# Altium schematic sheet LED_high_power.SchDoc: LED High Power
size B; SheetNumber: 12; SheetTotal: 14
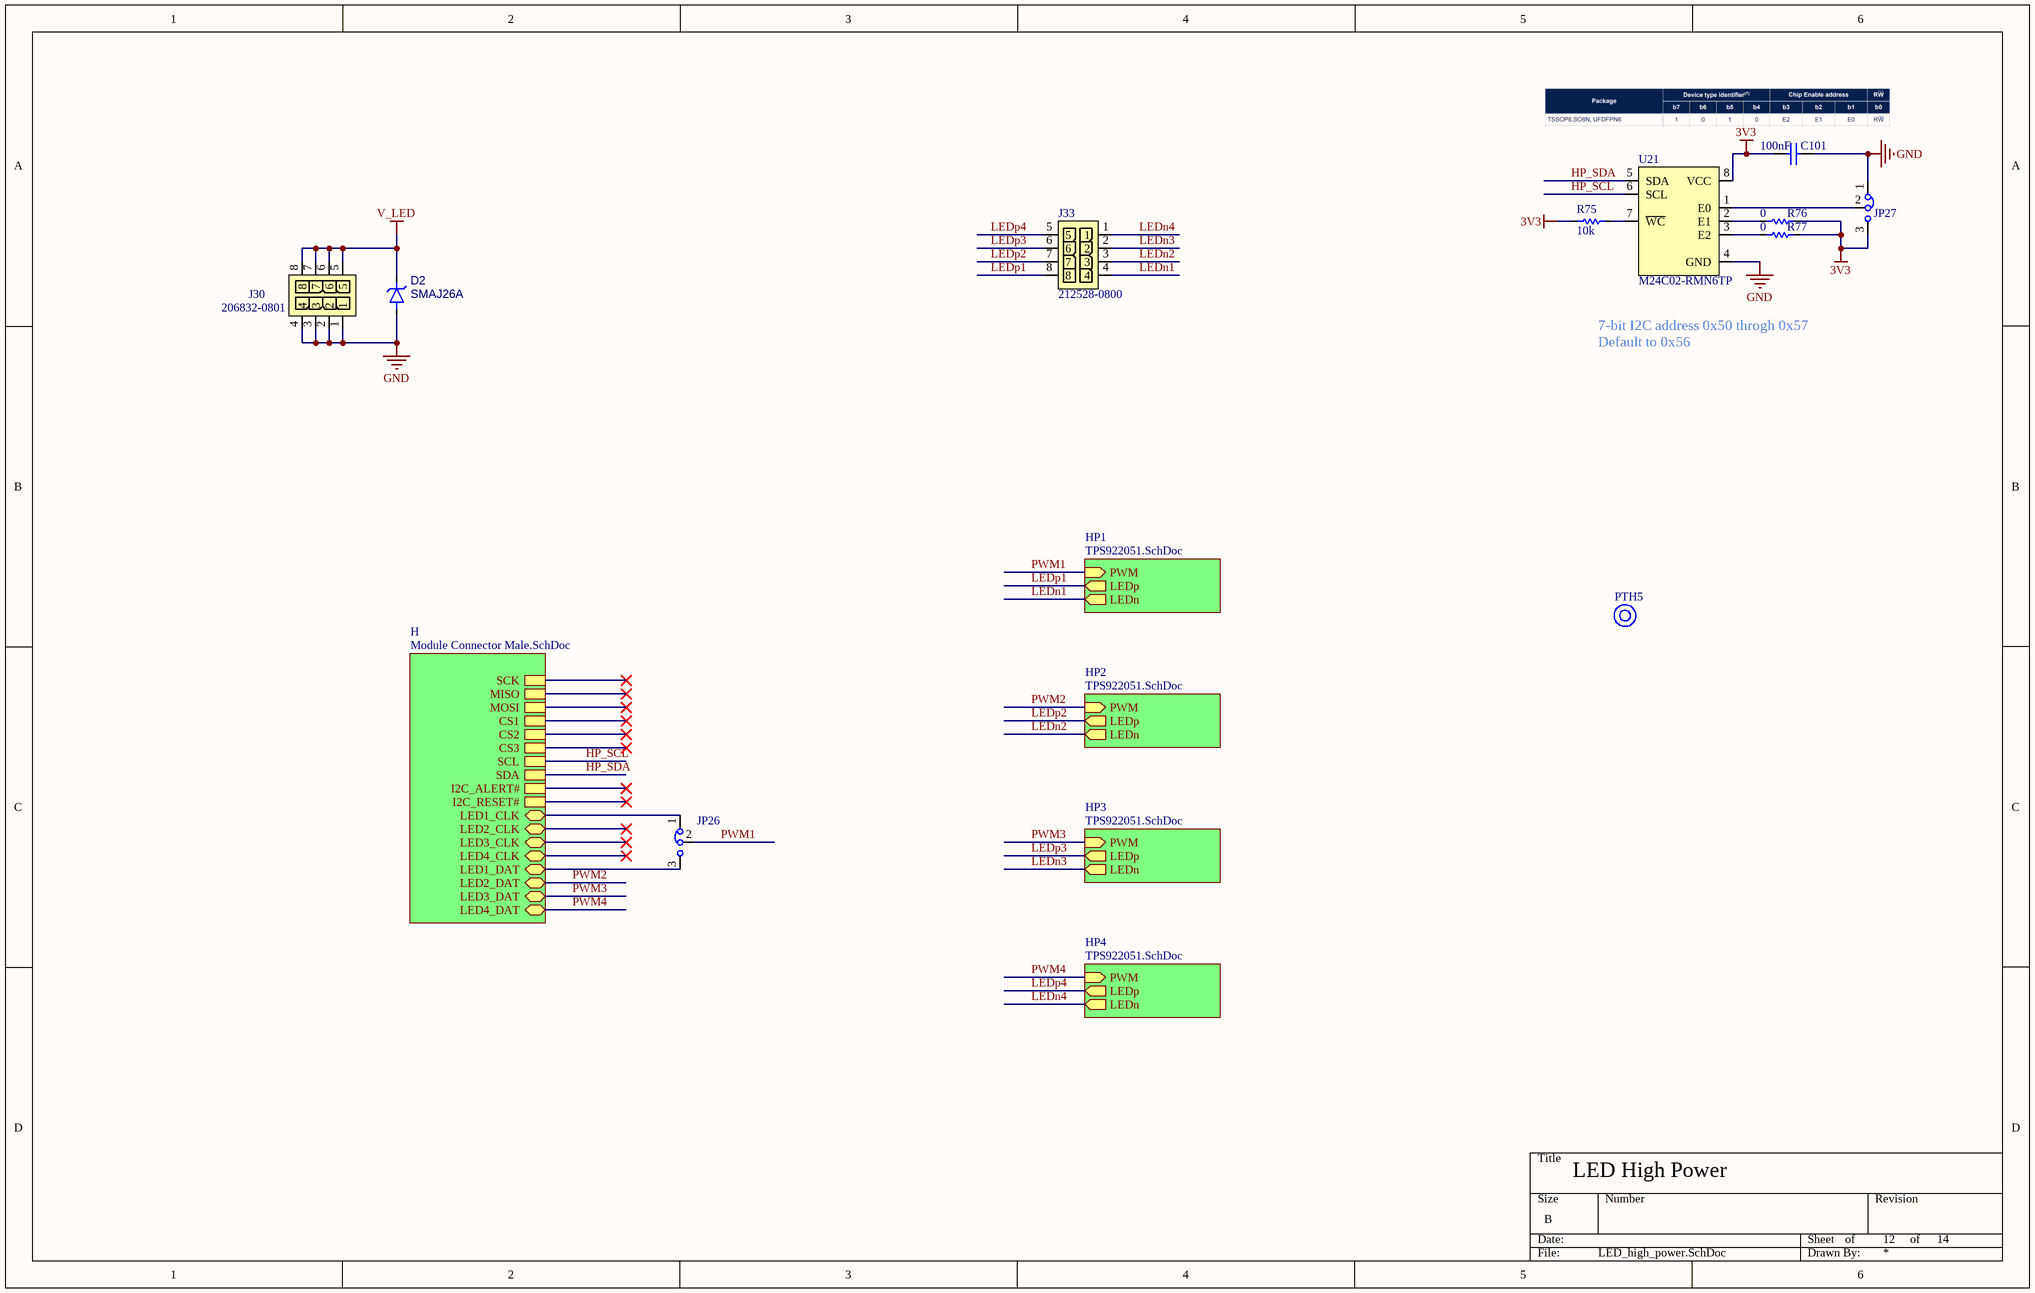
[diagram p0: LED_high_power.SchDoc]

## Parts
C101  value 100nF  [CAPC1608X10N_0603_MED]  (hidden comment: CC0603KRX7R0BB104)
D2  SMAJ26A  [FP-SMAJ-MFG]
J30  206832-0801  [206832-0801-Footprint-1]
J33  212528-0800  [212528-0800-Footprint]
JP26  Jumper 3 x 1 Bridge 1-2 Solder Bridge  [Jumper 3 Solder Bridge 1-2 0603]  (value not drawn)
JP27  Jumper 3 x 1 Bridge 1-2 Solder Bridge  [Jumper 3 Solder Bridge 1-2 0603]  (value not drawn)
PTH5  Mounting Hole NPTH  [Mounting Hole M3 No Washer NPTH]  (value not drawn)  (no BOM)
R75  value 10k  [RESC1608X06N_0603_MED]  (hidden comment: RC0603FR-1010KL)
R76  value 0  [RESC1608X06N_0603_MED]  (hidden comment: RC0603FR-070RL)
R77  value 0  [RESC1608X06N_0603_MED]  (hidden comment: RC0603FR-070RL)
U21  M24C02-RMN6TP  [M24C02-RMN6TP-SO8N-IPC_B]

## Sub-sheets
H = Module Connector Male.SchDoc: SCK, MISO, MOSI, CS1, CS2, CS3, SCL, SDA, I2C_ALERT#, I2C_RESET#, LED1_CLK (bidir), LED2_CLK (bidir), LED3_CLK (bidir), LED4_CLK (bidir), LED1_DAT (bidir), LED2_DAT (bidir), LED3_DAT (bidir), LED4_DAT (bidir)
HP1 = TPS922051.SchDoc: PWM (in), LEDp (out), LEDn (out)
HP2 = TPS922051.SchDoc: PWM (in), LEDp (out), LEDn (out)
HP3 = TPS922051.SchDoc: PWM (in), LEDp (out), LEDn (out)
HP4 = TPS922051.SchDoc: PWM (in), LEDp (out), LEDn (out)

## Nets
3V3: C101.1 JP27.3 R75.2 R76.1 R77.1 U21.8(VCC)
GND: C101.2 D2.2(A) J30.1 J30.2 J30.3 J30.4 JP27.1 U21.4(GND)
V_LED: D2.1(K) J30.5 J30.6 J30.7 J30.8
HP_SCL: U21.6(SCL) ; sheet H/SCL
HP_SDA: U21.5(SDA) ; sheet H/SDA
LEDn1: J33.4 ; sheet HP1/LEDn
LEDn2: J33.3 ; sheet HP2/LEDn
LEDn3: J33.2 ; sheet HP3/LEDn
LEDn4: J33.1 ; sheet HP4/LEDn
LEDp1: J33.8 ; sheet HP1/LEDp
LEDp2: J33.7 ; sheet HP2/LEDp
LEDp3: J33.6 ; sheet HP3/LEDp
LEDp4: J33.5 ; sheet HP4/LEDp
PWM1: JP26.2 ; sheet HP1/PWM
PWM2: sheet H/LED2_DAT, sheet HP2/PWM
PWM3: sheet H/LED3_DAT, sheet HP3/PWM
PWM4: sheet H/LED4_DAT, sheet HP4/PWM
NetJP26_1: JP26.1 ; sheet H/LED1_CLK
NetJP26_3: JP26.3 ; sheet H/LED1_DAT
NetJP27_2: JP27.2 U21.1(E0)
NetR75_1: R75.1 U21.7(~{WC})
NetR76_2: R76.2 U21.2(E1)
NetR77_2: R77.2 U21.3(E2)

## Notes on the sheet
- 7-bit I2C address 0x50 throgh 0x57
  Default to 0x56
- of

## Library data of the parts
C101 = CMP-001-00102-4: Ceramic Capacitor, Multilayer, Ceramic, 100V, 10% +Tol, 10% -Tol, X7R, 15% TC, 0.1uF, Surface Mount, 0603; Max Operating Temperature: 125°C; RoHS Compliant: Yes; Case/Package: 0603; Mounting Technology: Surface Mount; Capacitor Type: Ceramic; Pins: 2; Voltage Rating: 100V; Min Operating Temperature: -55°C; JLCPN: C113803
D2 = CMP-004-00046-2: Trans Voltage Suppressor Diode, 400W, 26V V(RWM), Unidirectional, 1 Element, Silicon, DO-214AC; Min Operating Temperature: -65°C; RoHS Compliant: Yes; Max Operating Temperature: 150°C; Pins: 2; JLCPN: C148225
J30 = CMP-002-00208-6: Micro-Fit+, Vertical Header, 8 pin; Max Current Rating: 12.5A; Connector Type: Micro-Fit+; Mounting Technology: Through Hole; Pins: 8
J33 = CMP-002-00231-1: Micro-Fit+ RA Header 8 Position; Gender: Male; Max Current Rating: 12.5A; Connector Type: Micro-Fit+; Pins: 8; Mounting Technology: Through Hole
JP26 JP27 = CMP-009-00341-2: 0603 Solder Bridge Jumper Surface Mount; Tolerance: 1%; Voltage Rating: 75V; Value: 0; Pins: 2; Case/Package: 0603; RoHS Compliant: Yes; Max Operating Temperature: 155°C; Min Operating Temperature: -55°C; Mounting Technology: Surface Mount
PTH5 = CMP-00028-00043-3
R75 = CMP-009-00306-2: Fixed Resistor, Metal Glaze/thick Film, 0.1W, 10000ohm, 75V, 1% +/-Tol, 100ppm/Cel, Surface Mount, 0603; Power: 100mW; Voltage Rating: 50V; Max Operating Temperature: 155°C; Case/Package: 0603; Mounting Technology: Surface Mount; Tolerance: 1%; Min Operating Temperature: -55°C; RoHS Compliant: Yes; Pins: 2; JLCPN: C98220
R76 R77 = CMP-009-00204-3: RC Series 0603 0.1 W 0 Ohm Jumper Surface Mount Thick Film Chip Resistor; Power: 100mW; Voltage Rating: 75V; Tolerance: 1%; Mounting Technology: Surface Mount; Pins: 2; Case/Package: 0603; Max Operating Temperature: 155°C; Min Operating Temperature: -55°C; RoHS Compliant: Yes; JLCPN: C100044
U21 = CMP-019-00078-2: M24C02 Series 2 Kb (256 x 8) 1.8 V SMT Serial I²C Bus EEPROM - SOIC-8; Max Supply Voltage: 5.5V; Min Supply Voltage: 1.8V; Frequency: 400kHz; Memory Size: 256B; Case/Package: SOIC; Pins: 8; Clock Frequency: 400kHz; Min Operating Temperature: -40°C; Memory Format: EEPROM; Max Operating Temperature: 85°C; Mounting Technology: Surface Mount; JLCPN: C83836